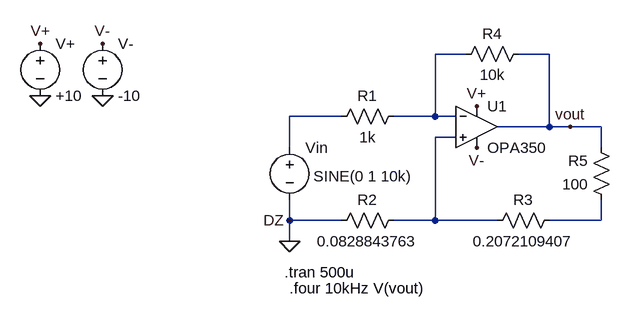
[diagram p0: schematic Lab 2 Experiment 7 - DaisyChain.asc]
Lab 2 Experiment 7 - DaisyChain.asc, the LTspice schematic file:
Version 4
SHEET 1 880 680
WIRE 176 80 128 80
WIRE 304 80 256 80
WIRE -16 176 -96 176
WIRE 128 176 128 80
WIRE 128 176 64 176
WIRE 160 176 128 176
WIRE 304 192 304 80
WIRE 304 192 224 192
WIRE 336 192 304 192
WIRE 384 192 336 192
WIRE 160 208 128 208
WIRE -96 224 -96 176
WIRE 384 224 384 192
WIRE -96 336 -96 304
WIRE -16 336 -96 336
WIRE 128 336 128 208
WIRE 128 336 64 336
WIRE 224 336 128 336
WIRE 384 336 384 304
WIRE 384 336 304 336
WIRE -96 368 -96 336
FLAG -480 144 0
FLAG -384 144 0
FLAG -480 64 V+
FLAG -384 64 V-
FLAG 192 160 V+
FLAG 192 224 V-
FLAG -96 368 0
FLAG -96 336 DZ
FLAG 336 192 vout
SYMBOL AutoGenerated\\OPA350 192 128 R0
SYMATTR InstName U1
SYMBOL voltage -480 48 R0
WINDOW 123 0 0 Left 0
WINDOW 39 0 0 Left 0
SYMATTR InstName V+
SYMATTR Value +10
SYMBOL voltage -384 48 R0
WINDOW 123 0 0 Left 0
WINDOW 39 0 0 Left 0
SYMATTR InstName V-
SYMATTR Value -10
SYMBOL voltage -96 208 R0
WINDOW 3 37 60 Left 2
WINDOW 123 0 0 Left 0
WINDOW 39 0 0 Left 0
SYMATTR Value SINE(0 1 10k)
SYMATTR InstName Vin
SYMBOL res 80 160 R90
WINDOW 0 0 56 VBottom 2
WINDOW 3 32 56 VTop 2
SYMATTR InstName R1
SYMATTR Value 1k
SYMBOL res 80 320 R90
WINDOW 0 0 56 VBottom 2
WINDOW 3 32 56 VTop 2
SYMATTR InstName R2
SYMATTR Value 0.0828843763
SYMBOL res 320 320 R90
WINDOW 0 0 56 VBottom 2
WINDOW 3 32 56 VTop 2
SYMATTR InstName R3
SYMATTR Value 0.2072109407
SYMBOL res 272 64 R90
WINDOW 0 0 56 VBottom 2
WINDOW 3 32 56 VTop 2
SYMATTR InstName R4
SYMATTR Value 10k
SYMBOL res 400 320 R180
WINDOW 0 36 76 Left 2
WINDOW 3 36 40 Left 2
SYMATTR InstName R5
SYMATTR Value 100
TEXT -104 416 Left 2 !.tran 500u
TEXT -96 440 Left 2 !.four 10kHz V(vout)

The netlist it stands for:
* Lab 2 Experiment 7 - DaisyChain.asc
* U1: OPA350 (symbol AutoGenerated\OPA350 not available, pins judged from their places): In+=N003 In-=N001 V+=V+ V-=V- OUT=vout
V+ V+ 0 +10
V- V- 0 -10
Vin N002 0 SINE(0 1 10k)
R1 N001 N002 1k
R2 N003 0 0.0828843763
R3 N004 N003 0.2072109407
R4 vout N001 10k
R5 N004 vout 100
.tran 500u
.four 10kHz V(vout)
.backanno
.end